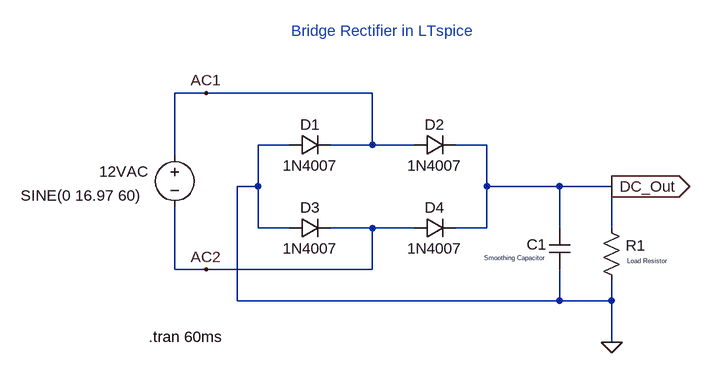
[diagram p0: schematic bridge_rectifier_schematic.asc]
bridge_rectifier_schematic.asc, the LTspice schematic file:
Version 4.1
SHEET 1 980 1188
WIRE 176 704 128 704
WIRE 432 704 176 704
WIRE 304 784 256 784
WIRE 432 784 432 704
WIRE 432 784 368 784
WIRE 496 784 432 784
WIRE 608 784 560 784
WIRE 128 800 128 704
WIRE 256 848 256 784
WIRE 256 848 224 848
WIRE 608 848 608 784
WIRE 720 848 608 848
WIRE 800 848 720 848
WIRE 256 912 256 848
WIRE 304 912 256 912
WIRE 432 912 368 912
WIRE 496 912 432 912
WIRE 608 912 608 848
WIRE 608 912 560 912
WIRE 720 912 720 848
WIRE 800 912 800 848
WIRE 128 976 128 880
WIRE 176 976 128 976
WIRE 432 976 432 912
WIRE 432 976 176 976
WIRE 224 1024 224 848
WIRE 720 1024 720 976
WIRE 720 1024 224 1024
WIRE 800 1024 800 992
WIRE 800 1024 720 1024
WIRE 800 1088 800 1024
FLAG 800 848 DC_Out
IOPIN 800 848 Out
FLAG 800 1088 0
FLAG 176 704 AC1
FLAG 176 976 AC2
SYMBOL voltage 128 784 R0
WINDOW 123 0 0 Left 0
WINDOW 39 0 0 Left 0
WINDOW 0 -116 41 Left 2
WINDOW 3 -237 78 Left 2
SYMATTR InstName 12VAC
SYMATTR Value SINE(0 16.97 60)
SYMBOL diode 304 800 R270
WINDOW 0 32 32 VTop 2
WINDOW 3 0 32 VBottom 2
SYMATTR InstName D1
SYMATTR Value 1N4007
SYMBOL diode 496 928 R270
WINDOW 0 32 32 VTop 2
WINDOW 3 0 32 VBottom 2
SYMATTR InstName D4
SYMATTR Value 1N4007
SYMBOL diode 496 800 R270
WINDOW 0 32 32 VTop 2
WINDOW 3 0 32 VBottom 2
SYMATTR InstName D2
SYMATTR Value 1N4007
SYMBOL diode 304 928 R270
WINDOW 0 32 32 VTop 2
WINDOW 3 0 32 VBottom 2
SYMATTR InstName D3
SYMATTR Value 1N4007
SYMBOL cap 704 912 R0
WINDOW 0 -35 25 Left 2
WINDOW 3 -100 46 Left 0
SYMATTR InstName C1
SYMATTR Value Smoothing Capacitor
SYMBOL res 784 896 R0
WINDOW 0 38 43 Left 2
WINDOW 3 40 67 Left 0
SYMATTR InstName R1
SYMATTR Value Load Resistor
TEXT 448 624 Bottom 2 ;Bridge Rectifier in LTspice
TEXT 88 1080 Left 2 !.tran 60ms

The netlist it stands for:
* bridge_rectifier_schematic.asc
V§12VAC AC1 AC2 SINE(0 16.97 60)
D1 0 AC1 1N4007
D4 AC2 DC_Out 1N4007
D2 AC1 DC_Out 1N4007
D3 0 AC2 1N4007
C1 DC_Out 0 Smoothing Capacitor
R1 DC_Out 0 Load Resistor
.model D D
.lib standard.dio
* Bridge Rectifier in LTspice
.tran 60ms
.backanno
.end